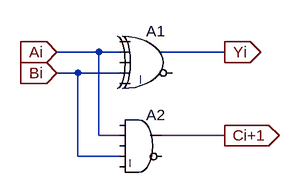
[diagram p0: schematic halfadder.asc]
halfadder.asc, the LTspice schematic file:
Version 4
SHEET 1 880 680
WIRE 112 176 48 176
WIRE 144 176 112 176
WIRE 304 176 208 176
WIRE 80 208 48 208
WIRE 144 208 80 208
WIRE 112 304 112 176
WIRE 144 304 112 304
WIRE 304 304 208 304
WIRE 80 336 80 208
WIRE 144 336 80 336
FLAG 48 176 Ai
IOPIN 48 176 In
FLAG 48 208 Bi
IOPIN 48 208 In
FLAG 304 176 Yi
IOPIN 304 176 Out
FLAG 304 304 Ci+1
IOPIN 304 304 Out
SYMBOL Digital\\xor 192 128 R0
SYMATTR InstName A1
SYMBOL Digital\\and 176 256 R0
SYMATTR InstName A2

The netlist it stands for:
* halfadder.asc
A1 0 Ai 0 Bi 0 0 Yi 0 XOR
A2 0 Ai 0 Bi 0 0 Ci+1 0 AND
.backanno
.end